# EAGLE design 7SegmentDisplay (EAGLE 9.4.2)
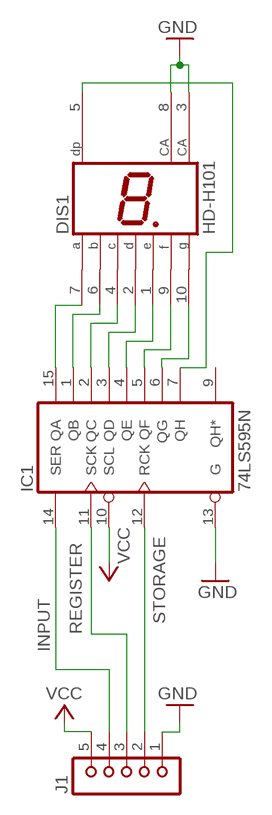
[diagram p0: schematic, sheet 1]

## Parts
DIS1  HD-H101  [HDSP-M]
IC1  74LS595N  [DIL16]
J1  JU05  [JU05]

## Nets
GND: DIS1.3(CA) DIS1.8(CA) IC1.13(G) J1.1
INPUT: IC1.14(SER) J1.4
N$1: DIS1.7(A) IC1.15(QA)
N$2: DIS1.6(B) IC1.1(QB)
N$3: DIS1.4(C) IC1.2(QC)
N$4: DIS1.2(D) IC1.3(QD)
N$5: DIS1.1(E) IC1.4(QE)
N$6: DIS1.9(F) IC1.5(QF)
N$7: DIS1.10(G) IC1.6(QG)
N$8: DIS1.5(DP) IC1.7(QH)
REGISTER: IC1.11(SCK) J1.3
STORAGE: IC1.12(RCK) J1.2
VCC: IC1.10(SCL) J1.5
Unconnected: IC1.9(QH*)

## Power pins joined to a net without a drawn wire
GND: IC1.8(GND)
VCC: IC1.16(VCC)

## Library data of the parts
DIS1 = display-hp:HD-H101: LED DISPLAY 1-character 7 segment, decimal point right; OC_FARNELL: unknown; OC_NEWARK: unknown
IC1 = 74xx-us:74*595: 8-bit SHIFT REGISTER, output latch; OC_NEWARK: unknown
J1 = con-lsta:JU05: PIN HEADER; OC_FARNELL: unknown; OC_NEWARK: unknown

## Board
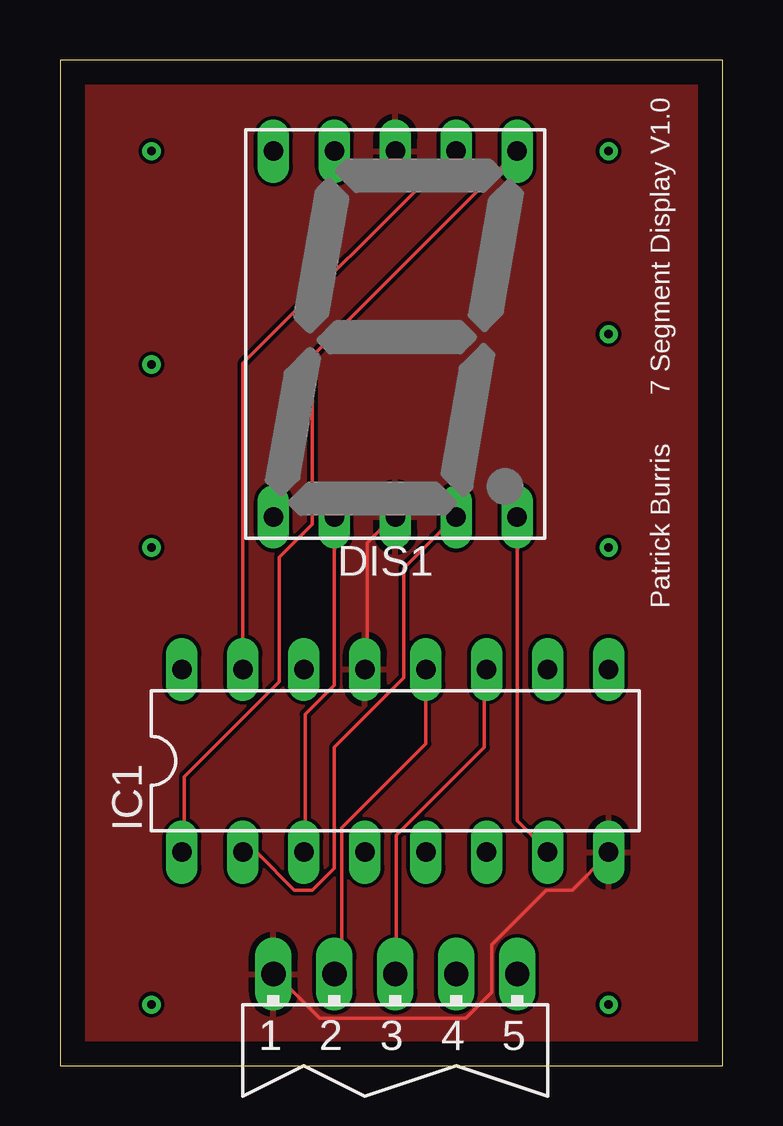
[diagram p1: board, top side]
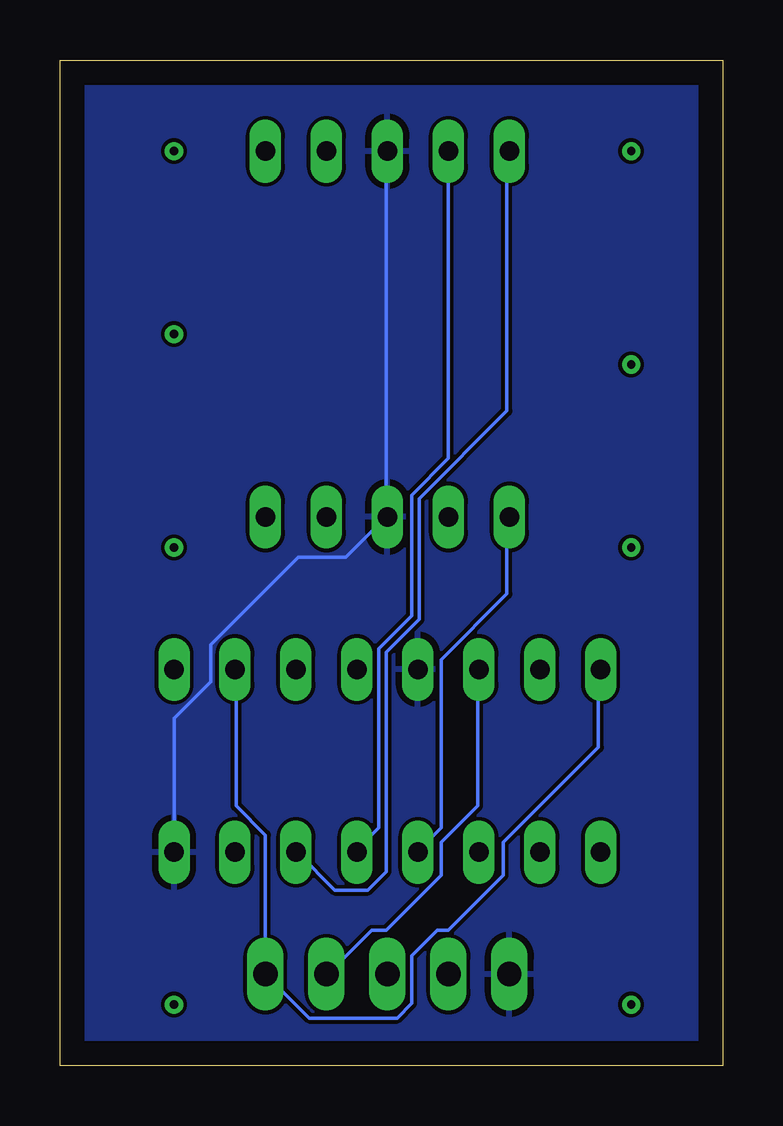
[diagram p2: board, bottom side, seen from below]

Size 27.61 x 41.9 mm. Coordinates in mm from the lower left corner, seen from the top.
Outline: 0,0 27.61,0 27.61,41.9 0,41.9 0,0
Copper layers (1*16): Top 0.035mm / dielectric 1.5mm / Bottom 0.035mm
Design rules "default": minimum track width 6mil, minimum drill 0.35mm, track to track 6mil, track to pad 6mil, pad to pad 6mil, via to via 6mil, smd to smd 6mil, copper to edge 40mil, drill to drill 6mil, minimum pad ring 10mil, minimum via ring 8mil, stop-mask expansion 4mil, vias tented up to drill 0mil, thermal gap 10mil

### Footprints (pad centres in the part's own frame; a part is rotated, then mirrored left to right if it is on the bottom)
HDSP-M = drill 0.813 long: 1 -5.08,-7.62; 2 -2.54,-7.62; 3 0,-7.62; 4 2.54,-7.62; 5 5.08,-7.62; 6 5.08,7.62; 7 2.54,7.62; 8 0,7.62; 9 -2.54,7.62; 10 -5.08,7.62
DIL16 = drill 0.813 long: 1 -8.89,-3.81; 2 -6.35,-3.81; 3 -3.81,-3.81; 4 -1.27,-3.81; 5 1.27,-3.81; 6 3.81,-3.81; 7 6.35,-3.81; 8 8.89,-3.81; 9 8.89,3.81; 10 6.35,3.81; 11 3.81,3.81; 12 1.27,3.81; 13 -1.27,3.81; 14 -3.81,3.81; 15 -6.35,3.81; 16 -8.89,3.81
JU05 = drill 1.016 long: 1 -5.08,0; 2 -2.54,0; 3 0,0; 4 2.54,0; 5 5.08,0

### Placement (x,y rotation side)
DIS1  13.97,30.48 0 top
IC1  13.97,12.7 0 top
J1  13.97,3.81 0 top

### Tracks (layer width: path | path; a pad name or v marks a point on that pad's centre or on a via)
GND
  Top 0.152: IC1.13 12.8,16.61 12.8,21.79 13.87,22.86 DIS1.3 | J1.1 8.99,3.81 10.82,1.98 16.92,1.98 17.98,3.05 17.98,5.03 20.27,7.32 21.34,7.32 22.86,8.84 IC1.8
  Bottom 0.152: 14.02,22.86 14.02,38.1 DIS1.8 | IC1.8 22.86,14.48 21.34,16 21.34,17.53 17.68,21.18 15.7,21.18 14.02,22.86 | 14.02,22.86 DIS1.3
  pour Top: -1.27,43.18 29.21,43.18 29.21,-1.27 -1.27,-1.27
  pour Bottom: -1.27,43.18 29.21,43.18 29.21,-1.27 -1.27,-1.27
INPUT
  Bottom 0.152: IC1.14 10.21,16.46 10.21,10.82 11.73,9.3 11.73,7.92 14.02,5.64 14.63,5.64 16.46,3.81 J1.4
N$1
  Top 0.152: IC1.15 7.62,29.26 16.46,38.1 DIS1.7
N$2
  Top 0.152: DIS1.6 10.52,29.57 10.52,22.55 9.14,21.18 9.14,16 5.18,12.04 5.18,8.99 IC1.1
N$3
  Top 0.152: IC1.2 7.62,8.84 8.23,8.84 9.75,7.32 10.52,7.32 11.43,8.23 11.43,13.26 14.33,16.15 14.33,20.73 16.46,22.86 DIS1.4
N$4
  Top 0.152: DIS1.2 11.43,15.85 10.21,14.63 10.21,8.99 IC1.3
N$5
  Bottom 0.152: DIS1.1 8.99,22.86 8.99,19.66 11.73,16.92 11.73,9.91 12.65,8.99 IC1.4
N$6
  Bottom 0.152: DIS1.9 11.43,25.3 12.95,23.77 12.95,18.75 14.33,17.37 14.33,9.91 15.24,8.99 IC1.5
N$7
  Bottom 0.152: DIS1.10 8.99,38.1 8.99,27.28 12.65,23.62 12.65,18.59 14.02,17.22 14.02,8.08 14.78,7.32 16.15,7.32 17.68,8.84 IC1.6
N$8
  Top 0.152: DIS1.5 19.05,10.21 20.27,8.99 IC1.7
N$9  (via drill 0.35)
  other vias: 3.81,2.54
N$10  (via drill 0.35)
  other vias: 3.81,21.59
N$11  (via drill 0.35)
  other vias: 3.81,29.21
N$12  (via drill 0.35)
  other vias: 3.81,38.1
N$13  (via drill 0.35)
  other vias: 22.86,38.1
N$14  (via drill 0.35)
  other vias: 22.86,30.48
N$15  (via drill 0.35)
  other vias: 22.86,21.59
N$16  (via drill 0.35)
  other vias: 22.86,2.54
REGISTER
  Top 0.152: IC1.11 17.68,16.46 17.68,13.26 14.02,9.6 14.02,3.81 J1.3
STORAGE
  Top 0.152: IC1.12 15.24,13.41 11.73,9.91 11.73,4.12 J1.2
VCC
  Bottom 0.152: IC1.16 5.18,16.46 5.18,13.26 9.14,9.3 9.14,7.92 11.43,5.64 11.89,5.64 12.95,4.57 12.95,2.59 13.56,1.98 17.22,1.98 J1.5 19.05,9.6 20.27,10.82 20.27,16.46 IC1.10

### Text on the board
tPlace: 7 Segment Display V1.0 | Patrick Burris